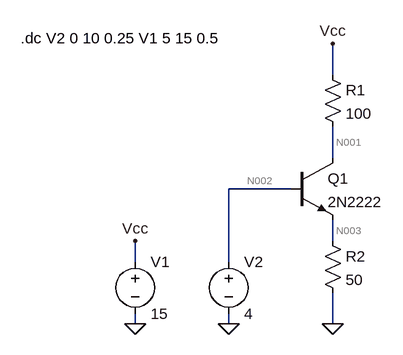
[diagram p0: schematic DC Sweep.asc]
DC Sweep.asc, the LTspice schematic file:
Version 4
SHEET 1 3528 680
WIRE 528 -576 528 -624
WIRE 528 -448 528 -496
WIRE 464 -400 368 -400
WIRE 528 -320 528 -352
WIRE 224 -288 224 -320
WIRE 368 -288 368 -400
WIRE 224 -192 224 -208
WIRE 368 -192 368 -208
WIRE 528 -192 528 -240
FLAG 224 -192 0
FLAG 224 -320 Vcc
FLAG 528 -624 Vcc
FLAG 528 -192 0
FLAG 368 -192 0
SYMBOL voltage 224 -304 R0
WINDOW 123 0 0 Left 0
WINDOW 39 0 0 Left 0
SYMATTR InstName V1
SYMATTR Value 15
SYMBOL res 512 -592 R0
SYMATTR InstName R1
SYMATTR Value 100
SYMBOL npn 464 -448 R0
SYMATTR InstName Q1
SYMATTR Value 2N2222
SYMBOL voltage 368 -304 R0
WINDOW 123 0 0 Left 0
WINDOW 39 0 0 Left 0
SYMATTR InstName V2
SYMATTR Value 4
SYMBOL res 512 -336 R0
SYMATTR InstName R2
SYMATTR Value 50
TEXT 48 -632 Left 2 !.dc V2 0 10 0.25 V1 5 15 0.5

The netlist it stands for:
* DC Sweep.asc
V1 Vcc 0 15
R1 Vcc N001 100
Q1 N001 N002 N003 0 2N2222
V2 N002 0 4
R2 N003 0 50
.model NPN NPN
.model PNP PNP
.lib standard.bjt
.dc V2 0 10 0.25 V1 5 15 0.5
.backanno
.end

* Results of the author's LTspice run, read from the files saved beside the schematic
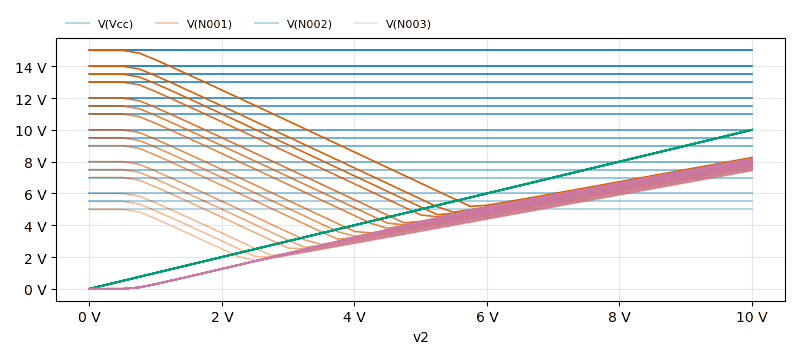
[diagram p1: DC transfer characteristic of DC Sweep.asc, plotted from the saved traces]
* DC transfer characteristic, 21 runs:
*   V(Vcc) [run 1]: 5 V at v2=0 V, 5 V at v2=10 V, min 5 V, max 5 V
*   V(Vcc) [run 2]: 5.5 V at v2=0 V, 5.5 V at v2=10 V, min 5.5 V, max 5.5 V
*   V(Vcc) [run 3]: 6 V at v2=0 V, 6 V at v2=10 V, min 6 V, max 6 V
*   V(Vcc) [run 4]: 7 V at v2=0 V, 7 V at v2=10 V, min 7 V, max 7 V
*   V(Vcc) [run 5]: 7.5 V at v2=0 V, 7.5 V at v2=10 V, min 7.5 V, max 7.5 V
*   V(Vcc) [run 6]: 8 V at v2=0 V, 8 V at v2=10 V, min 8 V, max 8 V
*   V(Vcc) [run 7]: 9 V at v2=0 V, 9 V at v2=10 V, min 9 V, max 9 V
*   V(Vcc) [run 8]: 9.5 V at v2=0 V, 9.5 V at v2=10 V, min 9.5 V, max 9.5 V
*   V(N001) [run 1]: 5 V at v2=0 V, 7.449 V at v2=10 V, min 1.786 V, max 7.449 V
*   V(N001) [run 2]: 5.5 V at v2=0 V, 7.489 V at v2=10 V, min 2.004 V, max 7.489 V
*   V(N001) [run 3]: 6 V at v2=0 V, 7.529 V at v2=10 V, min 2.097 V, max 7.529 V
*   V(N001) [run 4]: 7 V at v2=0 V, 7.61 V at v2=10 V, min 2.509 V, max 7.61 V
*   V(N001) [run 5]: 7.5 V at v2=0 V, 7.65 V at v2=10 V, min 2.609 V, max 7.65 V
*   V(N001) [run 6]: 8 V at v2=0 V, 7.691 V at v2=10 V, min 2.798 V, max 8 V
*   V(N001) [run 7]: 9 V at v2=0 V, 7.771 V at v2=10 V, min 3.121 V, max 9 V
*   V(N001) [run 8]: 9.5 V at v2=0 V, 7.812 V at v2=10 V, min 3.303 V, max 9.5 V
*   V(N002) [run 1]: 0 V at v2=0 V, 10 V at v2=10 V, min 0 V, max 10 V
*   V(N002) [run 2]: 0 V at v2=0 V, 10 V at v2=10 V, min 0 V, max 10 V
*   V(N002) [run 3]: 0 V at v2=0 V, 10 V at v2=10 V, min 0 V, max 10 V
*   V(N002) [run 4]: 0 V at v2=0 V, 10 V at v2=10 V, min 0 V, max 10 V
*   V(N002) [run 5]: 0 V at v2=0 V, 10 V at v2=10 V, min 0 V, max 10 V
*   V(N002) [run 6]: 0 V at v2=0 V, 10 V at v2=10 V, min 0 V, max 10 V
*   V(N002) [run 7]: 0 V at v2=0 V, 10 V at v2=10 V, min 0 V, max 10 V
*   V(N002) [run 8]: 0 V at v2=0 V, 10 V at v2=10 V, min 0 V, max 10 V
*   V(N003) [run 1]: 525 fV at v2=0 V, 7.414 V at v2=10 V, min 525 fV, max 7.414 V
*   V(N003) [run 2]: 527.5 fV at v2=0 V, 7.452 V at v2=10 V, min 527.5 fV, max 7.452 V
*   V(N003) [run 3]: 530 fV at v2=0 V, 7.491 V at v2=10 V, min 530 fV, max 7.491 V
*   V(N003) [run 4]: 535 fV at v2=0 V, 7.568 V at v2=10 V, min 535 fV, max 7.568 V
*   V(N003) [run 5]: 537.5 fV at v2=0 V, 7.606 V at v2=10 V, min 537.5 fV, max 7.606 V
*   V(N003) [run 6]: 540 fV at v2=0 V, 7.645 V at v2=10 V, min 540 fV, max 7.645 V
*   V(N003) [run 7]: 545 fV at v2=0 V, 7.722 V at v2=10 V, min 545 fV, max 7.722 V
*   V(N003) [run 8]: 547.5 fV at v2=0 V, 7.76 V at v2=10 V, min 547.5 fV, max 7.76 V